# Altium schematic sheet eps_imu.SchDoc
size A; SheetNumber: 17; SheetTotal: 19
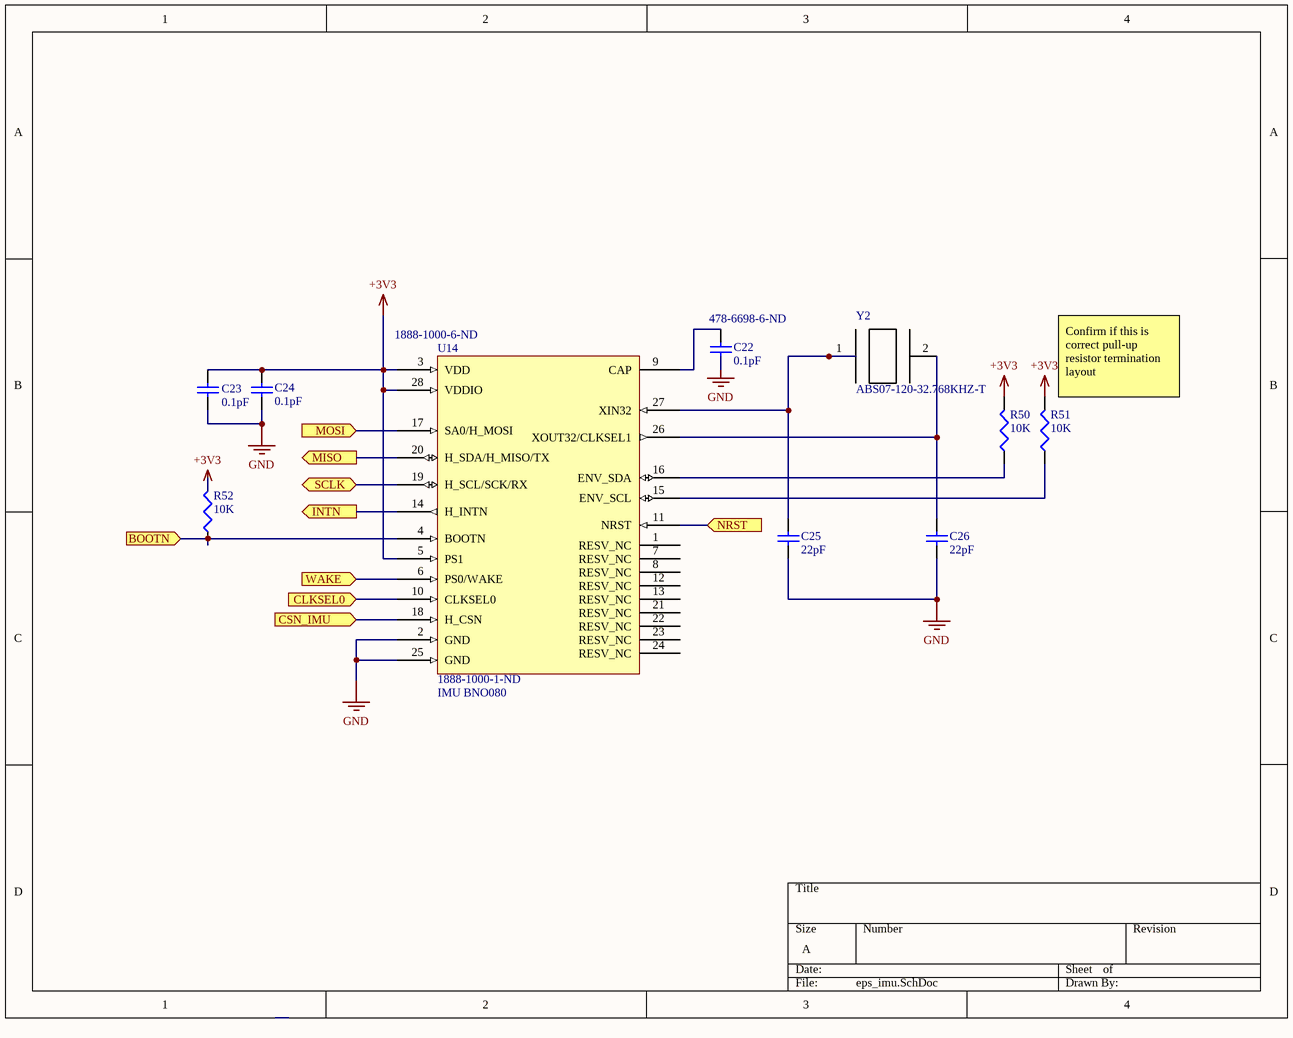
[diagram p0: eps_imu.SchDoc]

## Parts
C22  0.1pF  Supplier Part Number 1: 478-6698-6-ND  [1608[0603]]
C23  0.1pF  [1608[0603]]
C24  0.1pF  [1608[0603]]
C25  22pF  [1608[0603]]
C26  22pF  [1608[0603]]
R50  10K  [J1-0603]
R51  10K  [J1-0603]
R52  10K  [J1-0603]
U14  IMU BNO080  Supplier Part Number 1: 1888-1000-6-ND  [1888-1000-1-ND]
Y2  ABS07-120-32.768KHZ-T  [ABS07-120-32.768]

## Ports
BOOTN (in), CLKSEL0 (in), CSN_IMU (in), INTN (out), MISO (out), MOSI (in), NRST (in), SCLK (bidir), WAKE (in)

## Nets
+3V3: C23.2 C24.2 R50.2 R51.2 R52.2 U14.3(VDD) U14.5(PS1) U14.28(VDDIO)
GND: C22.1 C23.1 C24.1 C25.1 C26.1 U14.2(GND) U14.25(GND)
BOOTN: R52.1 U14.4(BOOTN) ; port BOOTN
CLKSEL0: U14.10(CLKSEL0) ; port CLKSEL0
CSN_IMU: U14.18(H_CSN) ; port CSN_IMU
INTN: U14.14(H_INTN) ; port INTN
MISO: U14.20(H_SDA/H_MISO/TX) ; port MISO
MOSI: U14.17(SA0/H_MOSI) ; port MOSI
NRST: U14.11(NRST) ; port NRST
SCLK: U14.19(H_SCL/SCK/RX) ; port SCLK
WAKE: U14.6(PS0/WAKE) ; port WAKE
NetC22_2: C22.2 U14.9(CAP)
NetC25_2: C25.2 U14.27(XIN32) Y2.1
NetC26_2: C26.2 U14.26(XOUT32/CLKSEL1) Y2.2
NetR50_1: R50.1 U14.16(ENV_SDA)
NetR51_1: R51.1 U14.15(ENV_SCL)

Not connected (* = marked no-connect by the designer): U14 1(RESV_NC) 7(RESV_NC) 8(RESV_NC) 12(RESV_NC) 13(RESV_NC) 21(RESV_NC) 22(RESV_NC) 23(RESV_NC) 24(RESV_NC)

## Notes on the sheet
- (near R51) Confirm if this is correct pull-up resistor termination layout
- (in symbol IMU BNO080) 1888-1000-1-ND

## Library data of the parts
C22-C26 = Cap Semi: Capacitor (Semiconductor SIM Model); Published: 8-Jun-2000; LatestRevisionDate: 29-May-2009; LatestRevisionNote: IPC-7351 Footprint Added.; PackageReference: C1206; Publisher: Altium Limited; PackageDescription: Chip Capacitor
  C22: Value: 0.1pF; Supplier 1: Digi-Key
  C23 C24: Value: 0.1pF
  C25: Value: 22pF; Supplier 1: Digi-Key; Supplier Part Number 1: 490-1411-6-ND
  C26: Value: 22pF
R50-R52 = Res3: Resistor; Published: 8-Jun-2000; LatestRevisionDate: 29-May-2009; LatestRevisionNote: IPC-7351 Footprint Added.; PackageReference: J1-0603; Publisher: Altium Limited; PackageDescription: Chip Resistor; Value: 10K
U14 = IMU BNO080: ACCEL/GYRO/MAG I2C 32BIT; Supplier 1: Digi-Key
Y2 = ABS07-120-32.768KHZ-T: 3.2 x 1.5mm, 32.768KHZ Xtal 6pf, 20ppm, -40+85C, ESR 60kOhm, ST Micro Ref Design Crystal for STM32L; MF: Abracon; MP: ABS07-120-32.768KHZ-T; SnapEDA_Link: https://www.snapeda.com/parts/ABS07-120-32.768KHZ-T/Abracon%20LLC/view-part/?ref=snap; Package: SMD-2 Abracon; Price: 0.37 USD; Availability: Good; Value: *; Supplier 1: Digi-Key; Supplier Part Number 1: 535-11937-1-ND